# EasyEDA Pro project CameraHub.eprj

# Schematic Schematic1
Board Name: Board1; Create Date: 2025-09-16; Page Name: P1; Project Name: CameraHub; Schematic Name: Schematic1; Update Date: 2025-09-17; Company: 嘉立创EDA; Page Size: A4; Version: V1.0
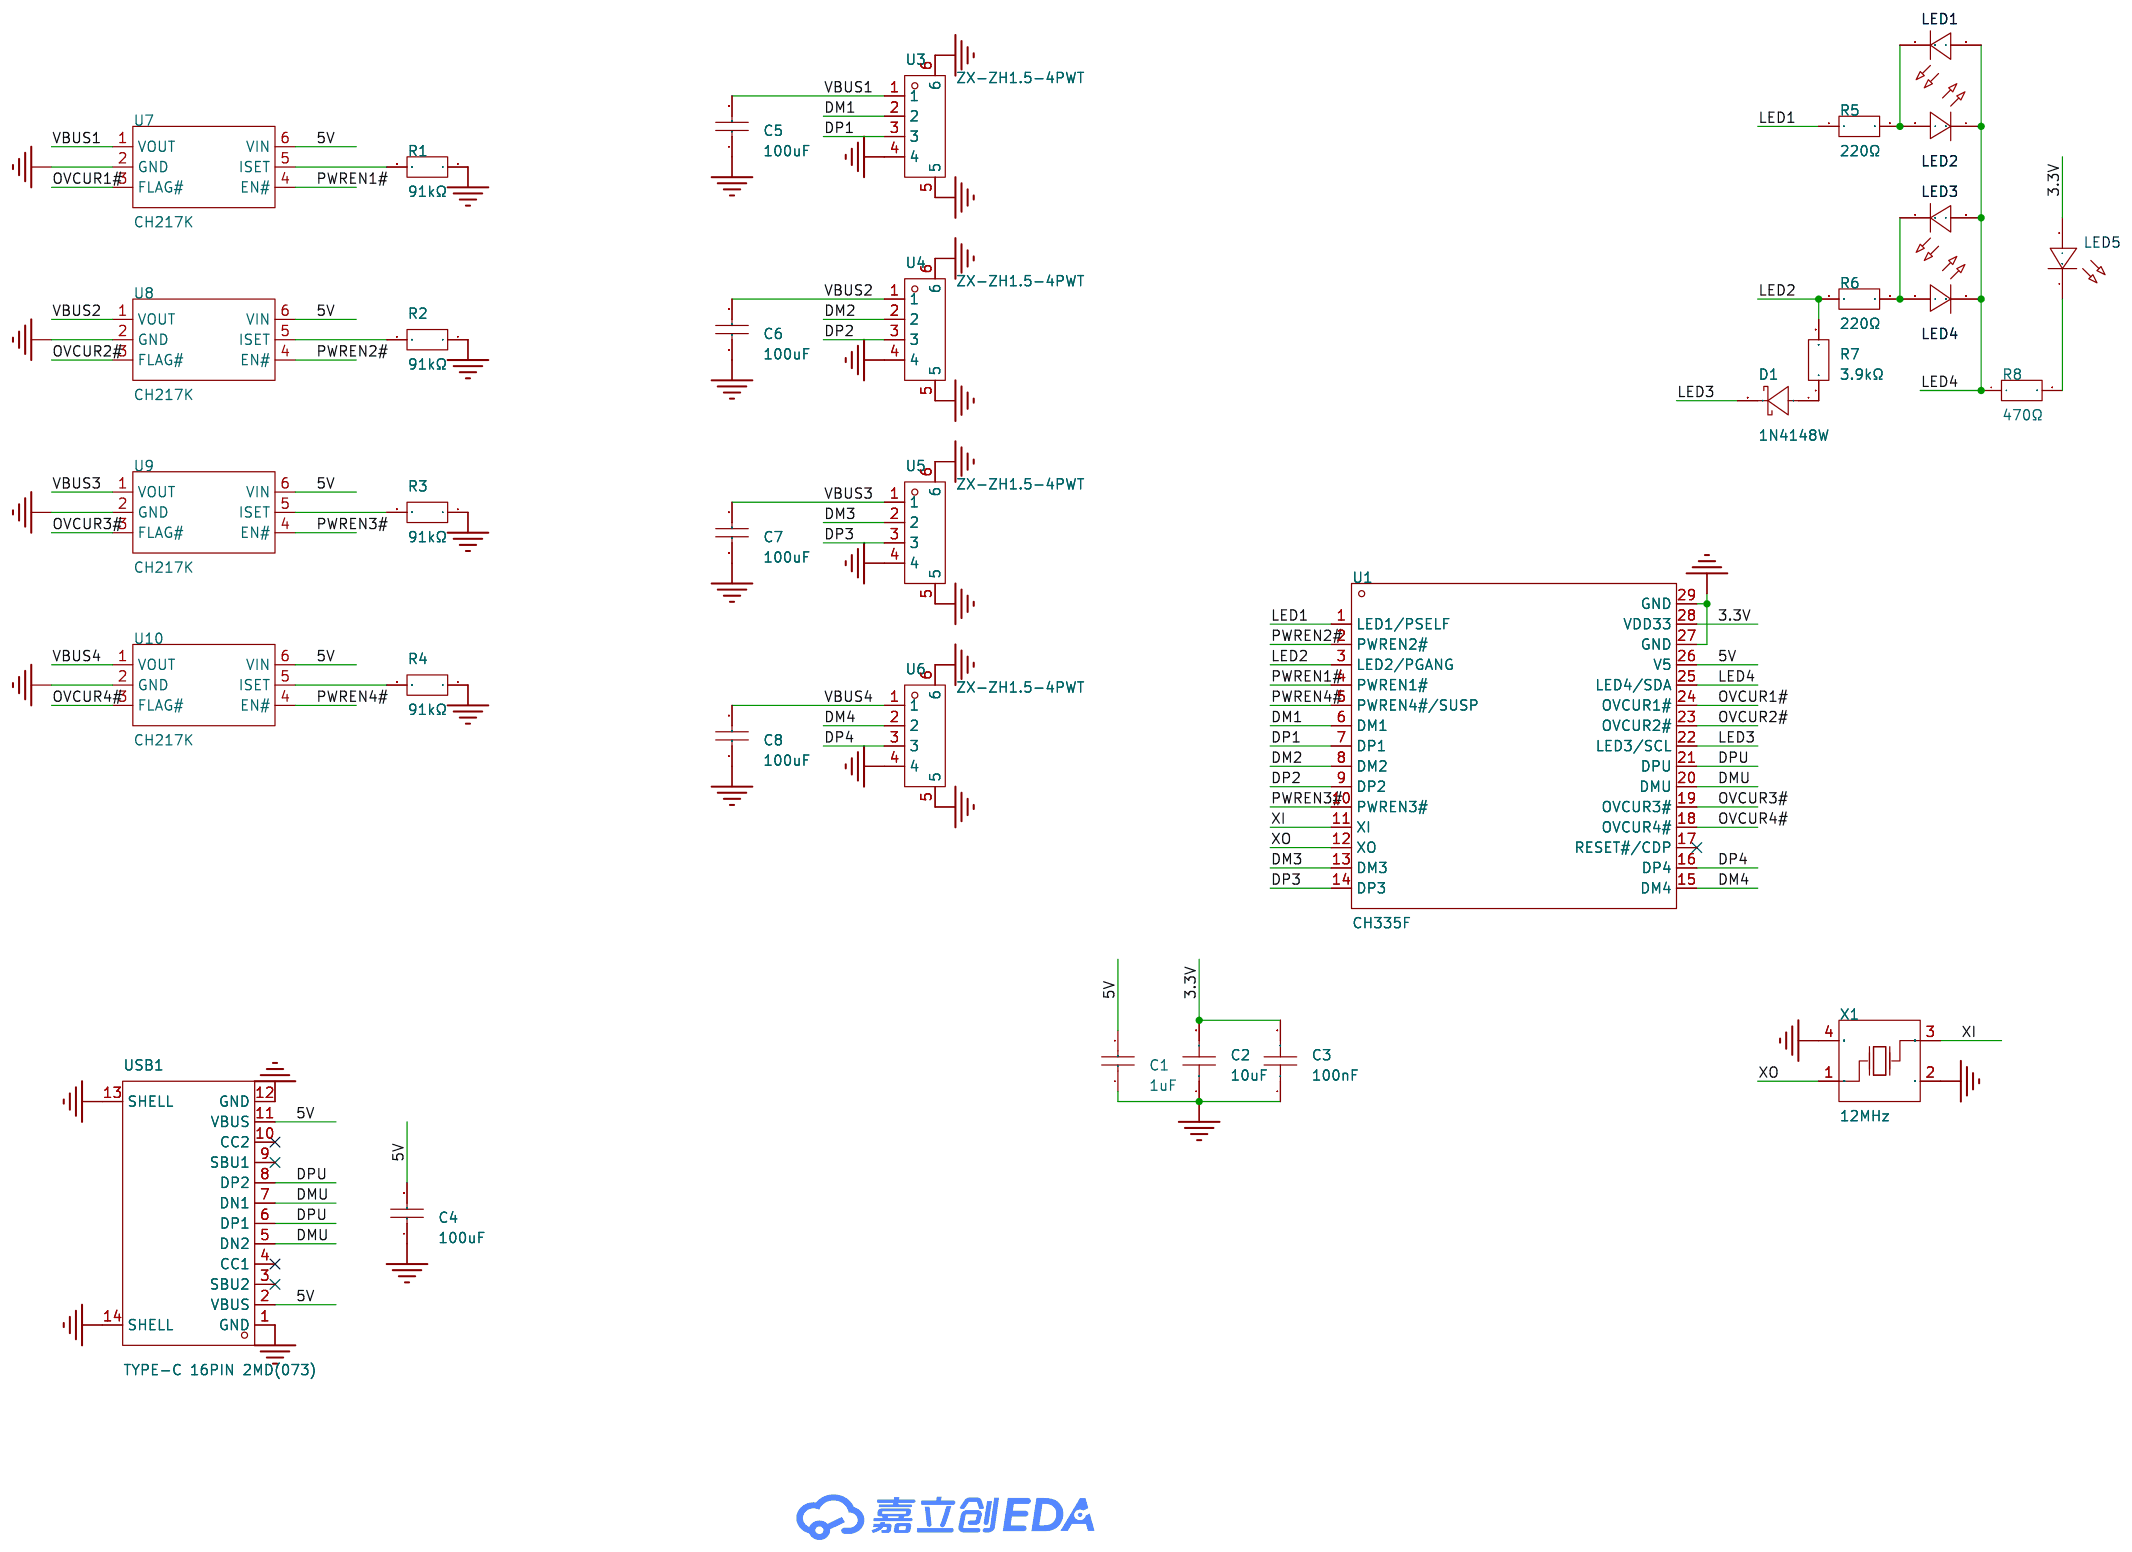
[diagram p0: schematic sheet]

## Parts
C1  1uF  [C0603]
C2  10uF  [C0603]
C3  100nF  [C0603]
C4  100uF  [C1206]
C5  100uF  [C1206]
C6  100uF  [C1206]
C7  100uF  [C1206]
C8  100uF  [C1206]
D1  1N4148W  [SOD-123_L2.7-W1.6-LS3.7-FD]
LED1  -  [LED_0603]
LED2  -  [LED_0603]
LED3  -  [LED_0603]
LED4  -  [LED_0603]
LED5  -  [LED_0603]
R1  91kΩ  [R0603]
R2  91kΩ  [R0603]
R3  91kΩ  [R0603]
R4  91kΩ  [R0603]
R5  220Ω  [R0603]
R6  220Ω  [R0603]
R7  3.9kΩ  [R0603]
R8  470Ω  [R0603]
U1  CH335F  [QFN-28_L4.0-W4.0-P0.40-BL-EP2.8]
U3  ZX-ZH1.5-4PWT  [CONN-SMD_4P-P1.50_ZX-ZH1.5-4PWT]
U4  ZX-ZH1.5-4PWT  [CONN-SMD_4P-P1.50_ZX-ZH1.5-4PWT]
U5  ZX-ZH1.5-4PWT  [CONN-SMD_4P-P1.50_ZX-ZH1.5-4PWT]
U6  ZX-ZH1.5-4PWT  [CONN-SMD_4P-P1.50_ZX-ZH1.5-4PWT]
U7  CH217K  [SOT-23-6_L2.9-W1.6-P0.95-LS2.8-BL]
U8  CH217K  [SOT-23-6_L2.9-W1.6-P0.95-LS2.8-BL]
U9  CH217K  [SOT-23-6_L2.9-W1.6-P0.95-LS2.8-BL]
U10  CH217K  [SOT-23-6_L2.9-W1.6-P0.95-LS2.8-BL]
USB1  TYPE-C 16PIN 2MD(073)  [USB-C-SMD_TYPE-C-6PIN-2MD-073]
X1  12MHz  [CRYSTAL-SMD_4P-L3.2-W2.5-BL]

## Library data of the parts
C1 = CL10A105KO8NNNC: LCSC Part Name: 1uF ±10% 16V; Supplier Part: C1592; Manufacturer: SAMSUNG(三星); Supplier Footprint: 0603; JLCPCB Part Class: 扩展库; Datasheet: https://item.szlcsc.com/datasheet/CL10A105KO8NNNC/1944.html; Supplier: LCSC; Tolerance: ±10%; Voltage Rating: 16V; Temperature Coefficient: X5R
C2 = CGA0603X5R106K100JT: LCSC Part Name: 10uF ±10% 10V; Supplier Part: C6119842; Manufacturer: HRE(芯声); Supplier Footprint: 0603; JLCPCB Part Class: 扩展库; Supplier: LCSC; Tolerance: ±10%; Voltage Rating: 10V; Temperature Coefficient: X5R
C3 = CGA0603X7R104K500JT: LCSC Part Name: 100nF ±10% 50V; Supplier Part: C6119867; Manufacturer: HRE(芯声); Supplier Footprint: 0603; JLCPCB Part Class: 扩展库; Datasheet: https://atta.szlcsc.com/upload/public/pdf/source/20250103/C44077DA9E7B3EFAE02F22B6D3D1CBC9.pdf; Supplier: LCSC; Tolerance: ±10%; Voltage Rating: 50V; Temperature Coefficient: X7R
C4-C8 = CL31A107MQHNNNE: LCSC Part Name: 100uF ±20% 6.3V; Supplier Part: C15008; Manufacturer: SAMSUNG(三星); Supplier Footprint: 1206; JLCPCB Part Class: 基础库; Datasheet: https://item.szlcsc.com/datasheet/CL31A107MQHNNNE/15681.html; Supplier: LCSC; Tolerance: ±20%; Voltage Rating: 6.3V; Temperature Coefficient: X5R
D1 = 1N4148W_C7420318: Supplier Part: C7420318; Manufacturer: R+O(宏嘉诚); Supplier Footprint: SOD-123; JLCPCB Part Class: 扩展库; Datasheet: https://item.szlcsc.com/datasheet/1N4148W/8397140.html; Supplier: LCSC; Diode Configuration: 独立式; Voltage - Forward(Vf@If): 1.25V@150mA; Voltage - DC Reverse(Vr): 100V; Current - Rectified: 150mA; Pd - Power Dissipation: 400mW; Reverse Leakage Current (Ir): 1uA@75V; Reverse Recovery Time (trr): 4ns; Operating Junction Temperature Range: -55℃~+150℃; Non-Repetitive Peak Forward Surge Current: 2A
LED1-LED4 = LED_0603-G: Supplier Footprint: 0603
LED5 = LED_0603-B: Supplier Footprint: 0603
R1-R4 = FRC0603F9102TS: LCSC Part Name: 91kΩ ±1% 100mW 厚膜电阻; Supplier Part: C2907077; Manufacturer: FOJAN(富捷); Supplier Footprint: 0603; JLCPCB Part Class: 扩展库; Supplier: LCSC; Type: 厚膜电阻; Tolerance: ±1%; Power(Watts): 100mW; Voltage-Supply(Max): 75V; Temperature Coefficient: ±100ppm/℃; Operating Temperature: -55℃~+155℃
R5 R6 = FRC0603J221 TS: LCSC Part Name: 220Ω ±5% 100mW 厚膜电阻; Supplier Part: C2907127; Manufacturer: FOJAN(富捷); Supplier Footprint: 0603; JLCPCB Part Class: 扩展库; Supplier: LCSC; Type: 厚膜电阻; Tolerance: ±5%; Power(Watts): 100mW; Voltage-Supply(Max): 75V; Temperature Coefficient: ±100ppm/℃; Operating Temperature: -55℃~+155℃
R7 = FRC0603F3901TS: LCSC Part Name: 3.9kΩ ±1% 100mW 厚膜电阻; Supplier Part: C2907024; Manufacturer: FOJAN(富捷); Supplier Footprint: 0603; JLCPCB Part Class: 扩展库; Supplier: LCSC; Type: 厚膜电阻; Tolerance: ±1%; Power(Watts): 100mW; Voltage-Supply(Max): 75V; Temperature Coefficient: ±100ppm/℃; Operating Temperature: -55℃~+155℃
R8 = FRC0603J471 TS: LCSC Part Name: 470Ω ±5% 100mW 厚膜电阻; Supplier Part: C2907172; Manufacturer: FOJAN(富捷); Supplier Footprint: 0603; JLCPCB Part Class: 扩展库; Supplier: LCSC; Type: 厚膜电阻; Tolerance: ±5%; Power(Watts): 100mW; Voltage-Supply(Max): 75V; Temperature Coefficient: ±100ppm/℃; Operating Temperature: -55℃~+155℃
U1 = CH335F_C5137013: Supplier Part: C5137013; Manufacturer: WCH(南京沁恒); Supplier Footprint: QFN-28(4x4); JLCPCB Part Class: 扩展库; Datasheet: https://item.szlcsc.com/datasheet/CH335F/5744739.html; Supplier: LCSC; type: 集线器; USB Protocol: USB 2.0; Data Rate: 480Mbps; Voltage - Supply: 3.3V；5V; Operating Temperature: -40℃~+85℃
U3-U6 = ZX-ZH1.5-4PWT: 插针结构:1x4P;间距:1.5mm;安装方式:卧贴;参考系列:ZH;总PIN数:4P;排数:1;每排PIN数:4;行距:-;额定电流:-;触头材质:黄铜;触头镀层:-;工作温度:-25℃~+85℃;; LCSC Part Name: 1x4P 间距:1.5mm 卧贴 系列:ZH; Supplier Part: C19272407; Manufacturer: Megastar(兆星); Supplier Footprint: SMD,P=1.5mm,卧贴; JLCPCB Part Class: 扩展库; Datasheet: https://item.szlcsc.com/datasheet/ZX-ZH1.5-4PWT/20550418.html; Supplier: LCSC; Pins Structure: 1x4P; Pitch: 1.5mm; Mounting Type: 卧贴; Reference Series: ZH; Number of Pins: 4P; Number of Rows: 1; Number of PINs Per Row: 4; Contact Material: 黄铜; Operating Temperature: -25℃~+85℃; Voltage Rating: 250V; Plastic Material: LCP; Supplementary Features: 辅助焊脚; Color: 米色; Z-Height of the Board: 3.8mm; X-Length of Bottom Edge on Board (Spacing Line): 9mm; Y-Width of Bottom Edge on Board: 6.5mm
U7-U10 = CH217K: LCSC Part Name: USB 限流配电开关芯片; Supplier Part: C7462749; Manufacturer: WCH(南京沁恒); Supplier Footprint: SOT-23-6; JLCPCB Part Class: 扩展库; Datasheet: https://item.szlcsc.com/datasheet/CH217K/8495424.html; Supplier: LCSC; Type: 负载开关; Number of Channels: 1; Control Input Logic: 低电平有效; Output Current: 2.7A; Voltage - Supply: 2.7V~5.5V; RDS(on): 70mΩ; Operating Temperature	-: -40℃~+85℃
USB1 = TYPE-C 16PIN 2MD(073): LCSC Part Name: Type-C 母 卧贴; Supplier Part: C2765186; Manufacturer: SHOU HAN(首韩); Supplier Footprint: SMD; JLCPCB Part Class: 扩展库; Datasheet: https://item.szlcsc.com/datasheet/TYPE-C%252016PIN%25202MD(073)/2901843.html; Supplier: LCSC; Connector Type: Type-C; Gender: 母; Mounting Type: 卧贴; Number of Contacts: 16P; Number of Ports: 1; Current Rating-Power: 3A; Voltage Rating: 5V; Connect-Disconnect Life: 5千次; Detection color: 黑色; Operating Temperature: -25℃~+85℃
X1 = TAXM12M4RLBDDT2T: LCSC Part Name: 12MHz ±10ppm 20pF; Supplier Part: C133334; Manufacturer: YJX(雅晶鑫); Supplier Footprint: SMD3225-4P; JLCPCB Part Class: 扩展库; Datasheet: https://item.szlcsc.com/datasheet/TAXM12M4RLBDDT2T/144638.html; Supplier: LCSC; Type: 贴片晶振; Normal temperature Frequency Tolerance: ±10ppm; Load Capacitance: 20pF; Frequency Stability: ±20ppm; Equivalent Series Resistance(ESR): 50Ω; Operating Temperature: -30℃~+85℃

## Nets
3.3V: C2.2 C3.2 LED5.2(A) U1.28(VDD33)
5V: C1.2 C4.2 U1.26(V5) U7.6(VIN) U8.6(VIN) U9.6(VIN) U10.6(VIN) USB1.2(VBUS) USB1.11(VBUS)
GND: C1.1 C2.1 C3.1 C4.1 C5.1 C6.1 C7.1 C8.1 R1.1 R2.1 R3.1 R4.1 U1.27(GND) U1.29(GND) U3.4 U3.5 U3.6 U4.4 U4.5 U4.6 U5.4 U5.5 U5.6 U6.4 U6.5 U6.6 U7.2(GND) U8.2(GND) U9.2(GND) U10.2(GND) USB1.1(GND) USB1.12(GND) USB1.13(SHELL) USB1.14(SHELL) X1.2(GND) X1.4(GND)
VBUS1: C5.2 U3.1 U7.1(VOUT)
VBUS2: C6.2 U4.1 U8.1(VOUT)
VBUS3: C7.2 U5.1 U9.1(VOUT)
VBUS4: C8.2 U6.1 U10.1(VOUT)
DM1: U1.6(DM1) U3.2
DM2: U1.8(DM2) U4.2
DM3: U1.13(DM3) U5.2
DM4: U1.15(DM4) U6.2
DMU: U1.20(DMU) USB1.5(DN2) USB1.7(DN1)
DP1: U1.7(DP1) U3.3
DP2: U1.9(DP2) U4.3
DP3: U1.14(DP3) U5.3
DP4: U1.16(DP4) U6.3
DPU: U1.21(DPU) USB1.6(DP1) USB1.8(DP2)
LED1: R5.1 U1.1(LED1/PSELF)
LED2: R6.1 R7.2 U1.3(LED2/PGANG)
LED3: D1.2(K) U1.22(LED3/SCL)
LED4: LED1.2(A) LED2.1(C) LED3.2(A) LED4.1(C) R8.1 U1.25(LED4/SDA)
OVCUR1#: U1.24(OVCUR1#) U7.3(FLAG#)
OVCUR2#: U1.23(OVCUR2#) U8.3(FLAG#)
OVCUR3#: U1.19(OVCUR3#) U9.3(FLAG#)
OVCUR4#: U1.18(OVCUR4#) U10.3(FLAG#)
PWREN1#: U1.4(PWREN1#) U7.4(EN#)
PWREN2#: U1.2(PWREN2#) U8.4(EN#)
PWREN3#: U1.10(PWREN3#) U9.4(EN#)
PWREN4#: U1.5(PWREN4#/SUSP) U10.4(EN#)
XI: U1.11(XI) X1.3(OSC2)
XO: U1.12(XO) X1.1(OSC1)
$1N1257: R1.2 U7.5(ISET)
$1N1269: R2.2 U8.5(ISET)
$1N1305: R3.2 U9.5(ISET)
$1N1330: R4.2 U10.5(ISET)
$1N3304: LED1.1(C) LED2.2(A) R5.2
$1N3315: LED3.1(C) LED4.2(A) R6.2
$1N3625: LED5.1(C) R8.2
$1N6368: D1.1(A) R7.1

Not connected (* = marked no-connect by the designer): U1 17(RESET#/CDP)*; USB1 3(SBU2)* 4(CC1)* 9(SBU1)* 10(CC2)*

# Board PCB1
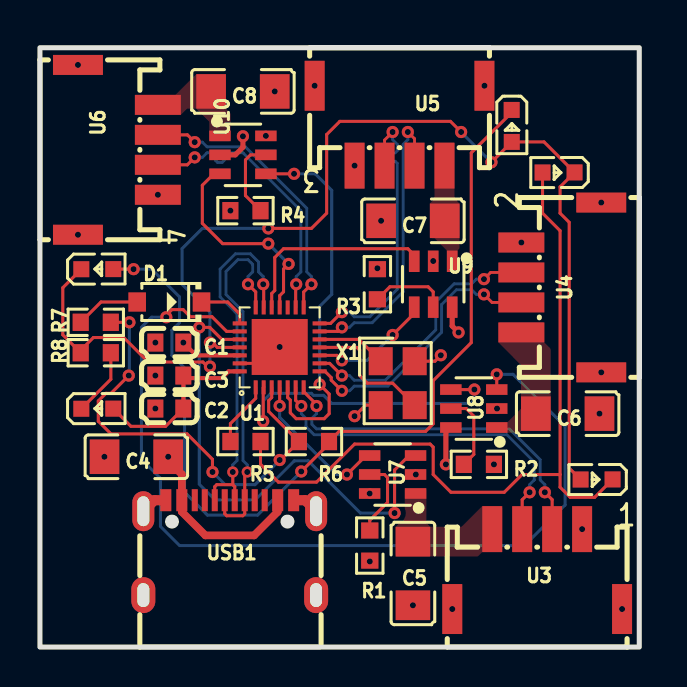
[diagram p1: board, top side]
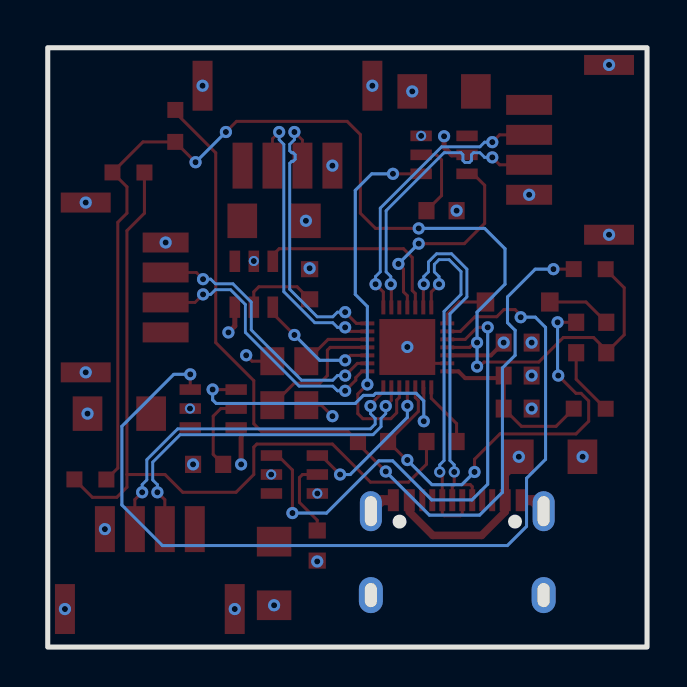
[diagram p2: board, bottom side, seen from below]

Outline 30 x 30 mm; copper layers: Top Layer, Inner1, Inner2, Bottom Layer. Coordinates in mm from the lower left corner of the outline.
Outline path: rectangle 0,30 30,0
Stack: Top Layer 0.035mm 外层铜厚1oz / Dielectric1 0.2104mm 7628 RC49% 8.6mil / Inner1 0.0152mm 内层铜厚 / Dielectric2 1.065mm 1.1mm H/HOZ Copper / Inner2 0.0152mm 内层铜厚 / Dielectric3 0.2104mm 7628 RC49% 8.6mil / Bottom Layer 0.035mm 外层铜厚1oz

## Design rules (mm)
net DM1: DP1
net DP1: DP1
net DM2: DP2
net DP2: DP2
net DM3: DP3
net DP3: DP3
net DM4: DP4
net DP4: DP4
net DMU: DPU
net DPU: DPU
template: 自定义配置
spacing copperThickness1oz (default): track to track 0.102, other pairs 0.152 to 0.3
spacing copperThickness2oz: track to track 0.203, other pairs 0.152 to 0.3
track width copperThickness1oz (default): min 0.127, default 0.152, max 2.54
track width copperThickness2oz: min 0.203, default 0.254, max 2.54
differential pair differentialPair (default): width min 0.127, default 0.142, max 2.54; gap min 0.152, default 0.152
via viaSize (default): diameter min 0.5, default 0.61, max 10; hole min 0.3, default 0.305, max 6.3

## Placement (name value [footprint] x y rotation side)
C1  1uF  [C0603]  6.48 15.24 0 top
C2  10uF  [C0603]  6.48 11.94 0 top
C3  100nF  [C0603]  6.48 13.59 0 top
C4  100uF  [C1206]  4.83 9.53 0 top
C5  100uF  [C1206]  18.67 3.68 90 top
C6  100uF  [C1206]  26.42 11.68 180 top
C7  100uF  [C1206]  18.67 21.34 0 top
C8  100uF  [C1206]  10.16 27.81 180 top
D1  1N4148W  [SOD-123_L2.7-W1.6-LS3.7-FD]  6.48 17.27 0 top
LED1  -  [LED_0603]  27.81 8.38 180 top
LED2  -  [LED_0603]  25.91 23.75 180 top
LED3  -  [LED_0603]  23.62 26.03 270 top
LED4  -  [LED_0603]  2.92 18.92 0 top
LED5  -  [LED_0603]  2.92 11.94 0 top
R1  91kΩ  [R0603]  16.51 5.08 90 top
R2  91kΩ  [R0603]  21.97 9.14 180 top
R3  91kΩ  [R0603]  16.89 18.16 270 top
R4  91kΩ  [R0603]  10.29 21.84 0 top
R5  220Ω  [R0603]  10.29 10.29 0 top
R6  220Ω  [R0603]  13.72 10.29 0 top
R7  3.9kΩ  [R0603]  2.79 16.26 0 top
R8  470Ω  [R0603]  2.79 14.73 0 top
U1  CH335F  [QFN-28_L4.0-W4.0-P0.40-BL-EP2.8]  12 15 0 top
U3  ZX-ZH1.5-4PWT  [CONN-SMD_4P-P1.50_ZX-ZH1.5-4PWT]  24.89 3.9 0 top
U4  ZX-ZH1.5-4PWT  [CONN-SMD_4P-P1.50_ZX-ZH1.5-4PWT]  26.1 18 90 top
U5  ZX-ZH1.5-4PWT  [CONN-SMD_4P-P1.50_ZX-ZH1.5-4PWT]  18 26.1 180 top
U6  ZX-ZH1.5-4PWT  [CONN-SMD_4P-P1.50_ZX-ZH1.5-4PWT]  3.9 24.89 270 top
U7  CH217K  [SOT-23-6_L2.9-W1.6-P0.95-LS2.8-BL]  17.65 8.64 90 top
U8  CH217K  [SOT-23-6_L2.9-W1.6-P0.95-LS2.8-BL]  21.72 11.94 90 top
U9  CH217K  [SOT-23-6_L2.9-W1.6-P0.95-LS2.8-BL]  19.69 18.16 180 top
U10  CH217K  [SOT-23-6_L2.9-W1.6-P0.95-LS2.8-BL]  10.16 24.64 270 top
USB1  TYPE-C 16PIN 2MD(073)  [USB-C-SMD_TYPE-C-6PIN-2MD-073]  9.5 4.97 0 top
X1  12MHz  [CRYSTAL-SMD_4P-L3.2-W2.5-BL]  17.91 13.21 270 top

## Footprints (pads in the part's own frame, mm; a bottom-side part is the same pattern mirrored in y, then rotated)
C0603
  rect 0.8x0.9 smd: 1(-0.7,0) 2(0.7,0)
C1206
  rect 1.485x1.728 smd: 1(-1.593,0) 2(1.593,0)
CONN-SMD_4P-P1.50_ZX-ZH1.5-4PWT
  rect 1x2.3 smd: 1(-2.25,2) 2(-0.75,2) 3(0.75,2) 4(2.25,2)
  rect 1x2.5 smd: 5(4.25,-2) 6(-4.25,-2)
CRYSTAL-SMD_4P-L3.2-W2.5-BL
  rect 1.4x1.2 smd: 1(-1.1,-0.85) 2(1.1,-0.85) 3(1.1,0.85) 4(-1.1,0.85)
LED_0603
  rect 0.8x0.8 smd: 1(-0.851,-0.01) 2(0.75,-0.005)
QFN-28_L4.0-W4.0-P0.40-BL-EP2.8
  rect 0.2x0.7 smd: 1(-1.2,-2) 2(-0.8,-2) 3(-0.4,-2) 4(-0.001,-2) 5(0.4,-2) 6(0.8,-2) 7(1.2,-2) 15(1.2,2) 16(0.8,2) 17(0.4,2) 18(0,2) 19(-0.4,2) 20(-0.8,2) 21(-1.2,2)
  rect 0.7x0.2 smd: 8(2,-1.2) 9(2,-0.8) 10(2,-0.4) 11(1.999,0) 12(2,0.4) 13(2,0.8) 14(2,1.2) 22(-2,1.2) 23(-2,0.8) 24(-2,0.4) 25(-2,0) 26(-2,-0.4) 27(-2,-0.8) 28(-2,-1.2)
  rect 2.8x2.8 smd: 29(0.001,0.02)
R0603
  rect 0.806x0.864 smd: 1(-0.753,0) 2(0.753,0)
SOD-123_L2.7-W1.6-LS3.7-FD
  rect 0.88x0.96 smd: 1(-1.61,0) 2(1.61,0)
SOT-23-6_L2.9-W1.6-P0.95-LS2.8-BL
  rect 0.532x1.072 smd: 1(-0.95,-1.149) 2(0,-1.149) 3(0.95,-1.149) 4(0.95,1.149) 5(0,1.149) 6(-0.95,1.149)
USB-C-SMD_TYPE-C-6PIN-2MD-073
  rect 0.55x1.1 smd: 1(-3.2,2.375) 2(-2.4,2.375) 11(2.4,2.375) 12(3.2,2.375)
  rect 0.3x1.1 smd: 3(-1.75,2.375) 4(-1.25,2.375) 5(-0.75,2.375) 6(-0.25,2.375) 7(0.25,2.375) 8(0.75,2.375) 9(1.25,2.375) 10(1.75,2.375)
  oval 1.1x2 hole 0.6x1.5: 13(-4.325,1.825) 14(4.325,1.825)
  oval 1.2x1.8 hole 0.6x1.2: 13(-4.325,-2.375) 14(4.325,-2.375)

## Nets
As in the schematic.

Pads without a net: U1 17; USB1 3 4 9 10

## Via types
v1: diameter 0.61, hole 0.305, Top Layer to Bottom Layer, 75 vias
v2: diameter 0.508, hole 0.305, Top Layer to Bottom Layer, 5 vias
v3: diameter 0.559, hole 0.305, Top Layer to Bottom Layer, 2 vias

## Routing (per net, layer and track width the routed paths; a pad name or vN(x,y) marks a point on that pad's centre or on a via; arc(x,y) is an arc through that point)
3.3V: length 8.9
  Top Layer w0.152: LED5.2 4.55,11.05 6.29,11.05 C2.2
  Top Layer w0.203: 7.18,13.54 7.3,13.54 7.38,13.46 9.1,13.46 9.44,13.8 U1.28 ; 7.18,13.54 C3.2 ; 7.18,13.54 C2.2
5V: length 16
  Top Layer w0.203: U1.26 7.82,14.6 v1(7.18,15.24)
  Top Layer w0.254: v1(20.32,9.14) 20.32,10.99 U8.6 ; U9.6 20.63,16.07 v1(20.96,15.75)
  Top Layer w0.381: USB1.11 11.9,6.77 10.72,5.59 8.28,5.59 7.1,6.77 USB1.2 7.1,8.65 6.42,9.33 v1(6.42,9.53)
  vias: v2(11.31,25.59) v2(16.5,7.69)
GND: length 9.9
  Top Layer w0.152: v1(20.07,14.61) 19.77,14.31 X1.4 ; U1.27 11.18,14.2 v1(12,15.02) ; v1(15.75,11.56) 16.3,12.11 17.06,12.11
  Top Layer w0.254: v1(10.16,25.57) 10.16,25.02 9.78,24.64 U10.2
  Top Layer w0.508: USB1.12 13.28,7.35 USB1.14 ; USB1.13 5.72,7.35 USB1.1
  vias: v1(1.9,29.14) v1(1.9,20.64) v1(3.23,9.53) v1(5.78,15.24) v1(5.78,13.59) v1(5.78,11.94) v1(5.9,22.64) v1(9.53,21.84) v1(11.75,27.81) v1(13.75,28.1) v1(15.75,24.1) v1(16.51,4.28) v1(16.89,18.96) v1(17.08,21.34) v1(18.67,2.09) v1(20.64,1.9) v1(22.25,28.1) v1(22.72,9.14) v1(24.1,20.25) v1(27.14,5.9) v1(28.01,11.68) v1(28.1,22.25) v1(28.1,13.75) v1(29.14,1.9) v2(18.82,8.64) v2(19.69,19.32) v2(22.88,11.94)
DM1: length 17.9
  Top Layer w0.152: v1(24.51,7.75) 24.14,7.38 U3.2 ; U1.6 12.8,12.35 v1(13.08,12.06)
  Bottom Layer w0.142: v1(24.51,7.75) 24.51,8.13 24.74,8.37 24.74,9.26 23.37,10.63 13.72,10.63 13.31,11.03 13.31,11.45 13.08,11.68 v1(13.08,12.06)
DM2: length 13.7
  Top Layer w0.142: U4.2 22.63,17.25 v1(22.22,17.65)
  Top Layer w0.152: U1.8 14.27,13.8 14.58,13.49 14.58,13.36 v1(15.11,12.83)
  Bottom Layer w0.142: v1(15.11,12.83) 15.5,12.83 15.73,13.06 17.41,13.06 20.11,15.75 20.11,17.14 20.85,17.89 21.61,17.89 21.84,17.65 v1(22.22,17.65)
DM3: length 14.9
  Top Layer w0.142: U5.2 18.75,25.45 v1(18.41,25.78)
  Top Layer w0.152: U1.13 14.91,15.8 v1(15.11,16)
  Bottom Layer w0.142: v1(18.41,25.78) 18.41,25.4 18.18,25.16 18.18,17.78 16.63,16.24 15.73,16.24 15.5,16 v1(15.11,16)
DM4: length 14.2
  Top Layer w0.152: v1(7.75,25.27) 7.38,25.64 U6.2 ; U1.15 13.2,17.77 v1(13.59,18.16)
  Bottom Layer w0.142: v1(7.75,25.27) 8.13,25.27 8.37,25.04 10.28,25.04 13.36,21.97 13.36,18.78 13.59,18.55 v1(13.59,18.16)
DMU: length 18.5
  Top Layer w0.152: U1.20 11.2,18.14 v1(11.18,18.16) ; 9.65,8.13 9.75,8.03 USB1.7 ; 9.65,8.13 8.85,8.13 8.75,8.03 USB1.5 ; 9.65,8.13 v3(9.65,8.76)
  Bottom Layer w0.142: v3(9.65,8.76) 9.65,9.12 9.87,9.34 9.87,16.68 9.02,17.53 9.02,18.92 9.78,19.69 10.54,19.69 10.94,19.28 10.94,18.78 11.18,18.55 v1(11.18,18.16)
DP1: length 18.1
  Top Layer w0.152: v1(13.84,12.06) 13.84,12.1 13.72,12.23 13.72,12.27 13.2,12.78 U1.7 ; v1(25.27,7.75) 25.64,7.38 U3.3
  Bottom Layer w0.142: v1(13.84,12.06) 13.84,11.68 13.61,11.45 13.61,11.16 13.84,10.92 23.5,10.92 25.04,9.38 25.04,8.37 25.27,8.13 v1(25.27,7.75)
DP2: length 13.5
  Top Layer w0.142: v1(22.22,18.42) 22.56,18.75 U4.3
  Top Layer w0.152: v1(15.11,13.59) 14.5,14.2 U1.9
  Bottom Layer w0.142: v1(22.22,18.42) 21.84,18.42 21.61,18.18 20.73,18.18 19.81,17.27 19.81,15.88 17.29,13.36 15.73,13.36 15.5,13.59 v1(15.11,13.59)
DP3: length 14.9
  Top Layer w0.142: v1(17.65,25.78) 17.25,25.38 U5.3
  Top Layer w0.152: U1.14 14.55,16.2 v1(15.11,16.76)
  Bottom Layer w0.142: v1(17.65,25.78) 17.65,25.4 17.89,25.16 17.89,24.84 17.79,24.74 17.72,24.74 17.62,24.64 17.62,24.42 17.72,24.31 17.79,24.31 17.89,24.21 17.89,17.91 16.51,16.53 15.73,16.53 15.5,16.76 v1(15.11,16.76)
DP4: length 14.3
  Top Layer w0.152: U6.3 7.38,24.14 v1(7.75,24.51) ; U1.16 12.8,18.13 v1(12.83,18.16)
  Bottom Layer w0.142: v1(7.75,24.51) 8.13,24.51 8.37,24.74 8.69,24.74 8.79,24.64 8.79,24.36 8.89,24.26 9.12,24.26 9.22,24.36 9.22,24.64 9.32,24.74 10.16,24.74 13.06,21.84 13.06,18.78 12.83,18.55 v1(12.83,18.16)
DPU: length 18.5
  Top Layer w0.152: U1.21 10.8,17.78 v1(10.41,18.16) ; USB1.6 9.25,6.67 9.35,6.57 10.15,6.57 10.25,6.67 USB1.8 10.25,8.64 v3(10.38,8.76)
  Bottom Layer w0.142: v1(10.41,18.16) 10.41,18.55 10.65,18.78 10.65,19.16 10.41,19.39 9.91,19.39 9.31,18.8 9.31,17.65 10.16,16.8 10.16,9.34 10.38,9.12 v3(10.38,8.76)
LED1: length 3.2
  Top Layer w0.152: R5.1 9.53,11.18 10.8,12.45 U1.1
LED2: length 22.7
  Top Layer w0.152: v1(4.44,13.59) 3.56,12.7 3.3,12.7 2.92,12.32 2.92,11.3 3.56,10.67 7.37,10.67 8.64,9.4 v1(8.64,8.76) ; v1(4.48,16.26) R7.2 ; U1.3 11.6,12.49 11.45,12.34 11.45,11.79 12.95,10.29 R6.1 12.04,9.36 v1(12,9.36)
  Bottom Layer w0.152: v1(8.64,8.76) 9.27,8.13 10.77,8.13 v1(12,9.36) ; v1(4.44,13.59) 4.48,13.62 v1(4.48,16.26)
LED3: length 2.6
  Top Layer w0.152: D1.2 9.4,17.27 10,16.67 U1.22
LED4: length 63.1
  Top Layer w0.152: v1(21.08,25.78) 20.55,26.31 15.01,26.31 14.35,25.65 14.35,21.72 13.59,20.95 v1(11.43,20.95) ; LED1.2 26.49,8.96 26.49,21.26 26.03,21.72 26.03,23.04 LED2.1 25.23,25.29 23.62,25.29 v1(22.6,24.27) ; LED4.1 1.14,17.99 1.14,15.63 R8.1 2.04,14.86 2.68,15.49 4.19,15.49 5.42,14.27 8.16,14.27 8.38,14.04 v1(8.51,14.04) ; U1.25 8.88,15 8.64,15.24 v1(8.51,15.24)
  Bottom Layer w0.152: v1(21.08,25.78) 22.59,24.27 v1(22.6,24.27) ; v1(8.51,14.04) v1(8.51,15.24) 8.51,16.76 7.11,18.16 7.11,19.94 8.13,20.95 v1(11.43,20.95)
OVCUR1#: length 25.6
  Top Layer w0.152: v1(17.75,6.71) 17.75,8.86 18.48,9.59 U7.3 ; U1.24 9.1,15.4 8.5,16 v1(7.98,16)
  Bottom Layer w0.152: v1(17.75,6.71) 16.04,6.71 13.43,9.32 12.73,9.32 10.78,7.37 8.76,7.37 7.98,8.15 v1(7.98,16)
OVCUR2#: length 46.9
  Top Layer w0.152: U1.23 9.35,15.8 8.61,16.53 7.52,16.53 7.17,16.89 6.6,16.89 6.32,16.61 v1(6.32,16.51) ; v1(22.87,13.65) U8.3
  Bottom Layer w0.152: v1(22.87,13.65) 23.69,13.65 26.29,11.05 26.29,7.11 24.26,5.08 6.99,5.08 6.03,6.04 6.03,8.45 5.08,9.4 5.08,16 5.59,16.51 v1(6.32,16.51)
OVCUR3#: length 10.2
  Top Layer w0.152: U9.3 18.74,19.62 18.41,19.94 12.19,19.94 11.75,19.5 11.75,17.85 11.6,17.7 U1.19
OVCUR4#: length 10.5
  Top Layer w0.152: U10.3 8.7,23.69 8.13,23.11 8.13,21.21 9.14,20.19 v1(11.43,20.19) ; v1(12.45,19.18) 12.19,18.92 12.19,17.78 12,17.59 U1.18
  Bottom Layer w0.152: v1(11.43,20.19) v1(12.45,19.18)
PWREN1#: length 7.6
  Top Layer w0.152: v1(15.37,8.64) 16.32,9.59 U7.4 ; v1(12,12.07) U1.4
  Bottom Layer w0.152: v1(12,12.07) 12,11.5 14.86,8.64 v1(15.37,8.64)
PWREN2#: length 15.4
  Top Layer w0.152: v1(21.75,12.89) 21.74,12.89 U8.4 ; U1.2 11.18,12.98 v1(11.18,11.3)
  Bottom Layer w0.152: v1(21.75,12.89) 21.75,12.37 21.56,12.19 14.6,12.19 14.2,12.6 13.69,12.6 13.59,12.7 11.56,12.7 11.18,12.32 v1(11.18,11.3)
PWREN3#: length 6.1
  Top Layer w0.152: v1(15.11,14.35) 14.86,14.6 U1.10 ; U9.4 18.74,16.7 v1(17.65,15.62)
  Bottom Layer w0.152: v1(15.11,14.35) 16.38,14.35 v1(17.65,15.62)
PWREN4#: length 18.8
  Top Layer w0.152: U10.4 v1(12.72,23.69) ; v1(14,13.15) 14.48,12.67 14.48,11.68 14.22,11.43 12.83,11.43 12.53,11.72 12.53,12.36 12.4,12.49 U1.5
  Bottom Layer w0.152: v1(12.72,23.69) 13.78,23.69 14.6,22.86 14.6,17.65 14,17.05 v1(14,13.15)
XI: length 6.7
  Top Layer w0.152: U1.11 15.86,15 16,14.86 16,13.59 16.38,13.21 17.66,13.21 X1.3
XO: length 3.5
  Top Layer w0.152: U1.12 15.97,15.4 17.06,14.31
$1N1257: length 4
  Top Layer w0.152: R1.2 16.51,6.35 17.4,7.24 17.4,8.48 17.25,8.64 U7.5
$1N1269: length 3.9
  Top Layer w0.152: U8.5 21.34,11.94 21.72,11.56 21.72,9.64 R2.2
$1N1305: length 3.9
  Top Layer w0.152: U9.5 19.69,17.78 19.43,18.03 17.52,18.03 R3.2
$1N1330: length 4
  Top Layer w0.152: U10.5 10.54,24.64 10.29,24.38 10.29,22.6 R4.2
$1N3304: length 38.8
  Top Layer w0.152: R5.2 11.04,9.15 11.94,8.25 13.84,8.25 15.75,10.16 19.53,10.16 19.69,10.01 19.69,8.64 20.57,7.75 23.24,7.75 24.13,8.64 26.03,8.64 ; LED1.1 27.76,7.49 26.54,7.49 26.03,8 26.03,8.64 ; 26.03,8.64 26.03,20.84 25.16,21.72 LED2.2
$1N3315: length 46.3
  Top Layer w0.152: v1(13.08,8.79) 14.47,10.18 R6.2 14.98,10.8 19.3,10.8 19.69,11.18 19.69,13.33 21.59,15.24 21.59,24.74 23.61,26.76 LED3.1 ; v1(4.69,18.92) 4.68,18.92 LED4.2
  Bottom Layer w0.152: v1(4.69,18.92) 5.6,18.92 6.99,17.53 6.99,16.24 6.6,15.85 6.6,14.61 7.24,13.97 7.24,7.75 8.38,6.6 10.89,6.6 v1(13.08,8.79)
$1N3625: length 3.4
  Top Layer w0.152: LED5.1 3.55,13.41 R8.2
$1N6368: length 3.2
  Top Layer w0.152: R7.1 3.06,17.27 D1.1

## Copper pours and planes (outline as drawn; the poured copper is in the pictures)
5V on Inner1: 0.26,29.74 29.74,29.74 29.74,0.26 0.26,0.26
GND on Inner2: 0.26,29.74 29.74,29.74 29.74,0.26 0.26,0.26
VBUS1 on Top Layer: 18.26,7.95 18.26,6.48 17.81,6.02 17.81,4.53 19.53,4.53 19.53,6.02 19.34,6.21 19.34,7.95
VBUS1 on Top Layer: 17.81,6.02 17.81,4.53 19.53,4.53 19.53,4.53 21.92,4.53 22.14,4.75 23.14,4.75 23.14,7.05 22.14,7.05 21.1,6.02
VBUS2 on Top Layer: 24.08,10.82 25.56,10.82 25.56,14.93 25.25,15.25 25.25,16.25 22.95,16.25 22.95,15.25 24.08,14.11
VBUS2 on Top Layer: 22.33,10.72 23.98,10.72 24.08,10.82 25.56,10.82 25.56,12.55 24.69,12.55 23.4,11.25 22.33,11.25
VBUS3 on Top Layer: 20.37,18.77 20.37,19.85 19.74,20.47 19.52,20.47 19.52,22.2 21,22.2 21,19.95 20.9,19.85 20.9,18.77
VBUS3 on Top Layer: 19.75,25.25 19.75,22.43 19.52,22.2 19.52,20.47 21,20.47 21,22.2 20.75,22.45 20.75,25.25
VBUS4 on Top Layer: 7.82,28.68 7.82,26.95 8.47,26.3 8.47,25.32 9.55,25.32 9.55,26.71 9.31,26.95 9.31,28.68
VBUS4 on Top Layer: 4.75,27.64 4.75,26.64 7.05,26.64 7.36,26.95 9.31,26.95 9.31,28.68 7.83,28.68 6.79,27.64

## Text on the board
Top Silkscreen Layer: 1 | 2 | 3 | 4
